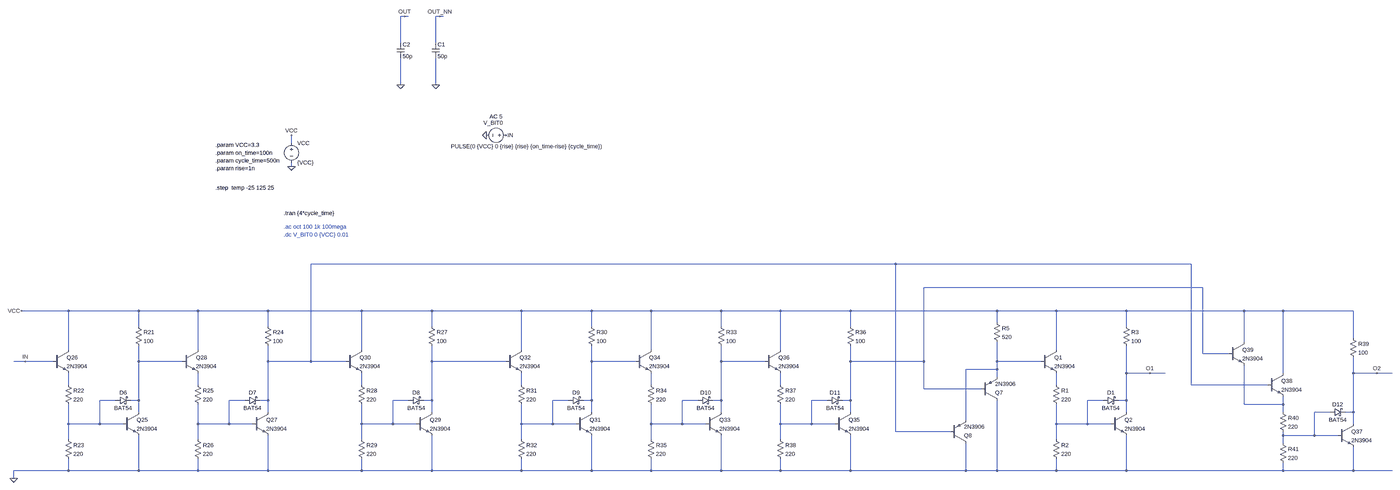
[diagram p0: schematic delay_line.asc, whole sheet]
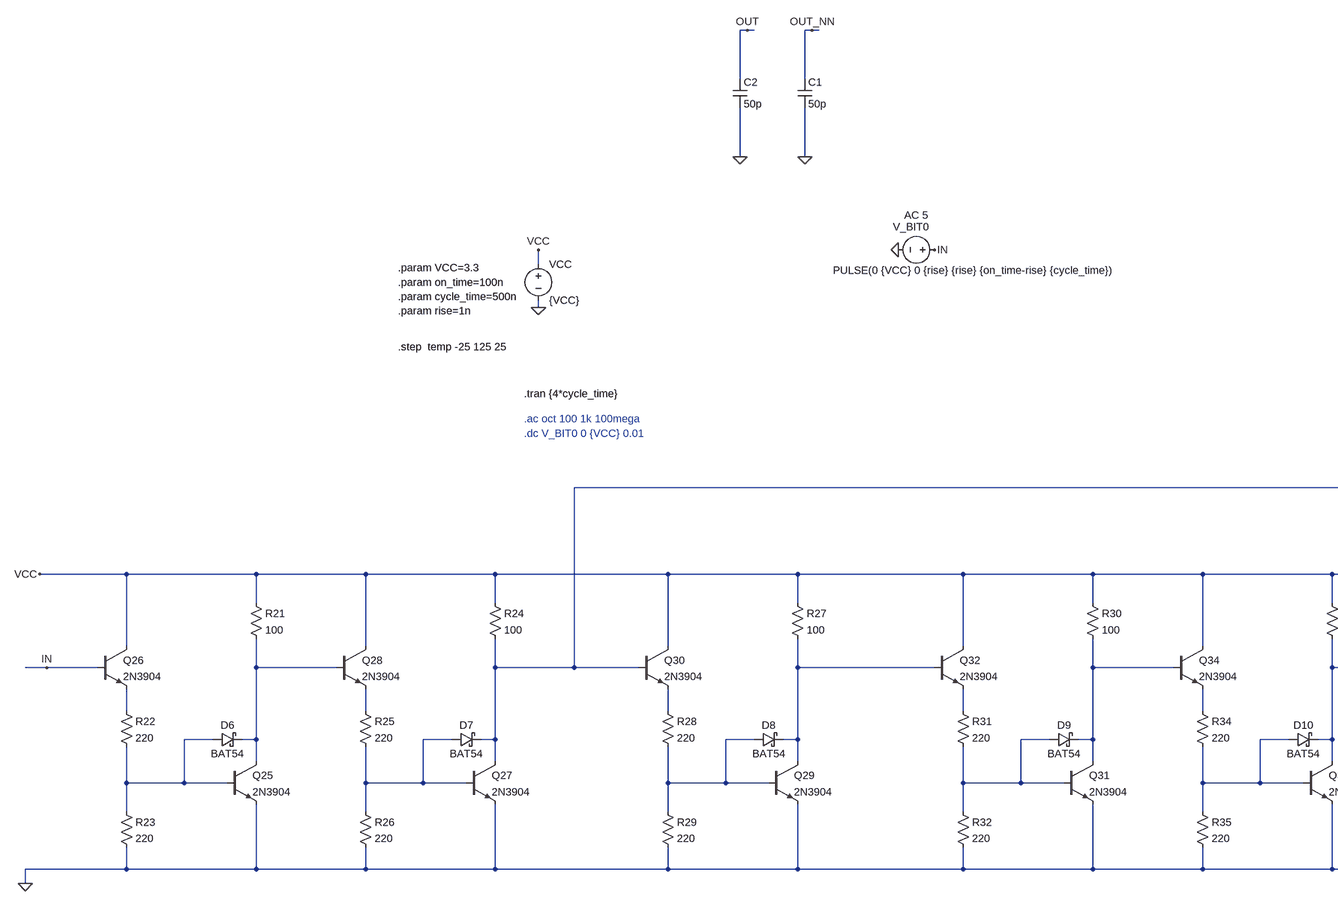
[diagram p1: schematic delay_line.asc, part, row 1 of 1, column 1 of 2]
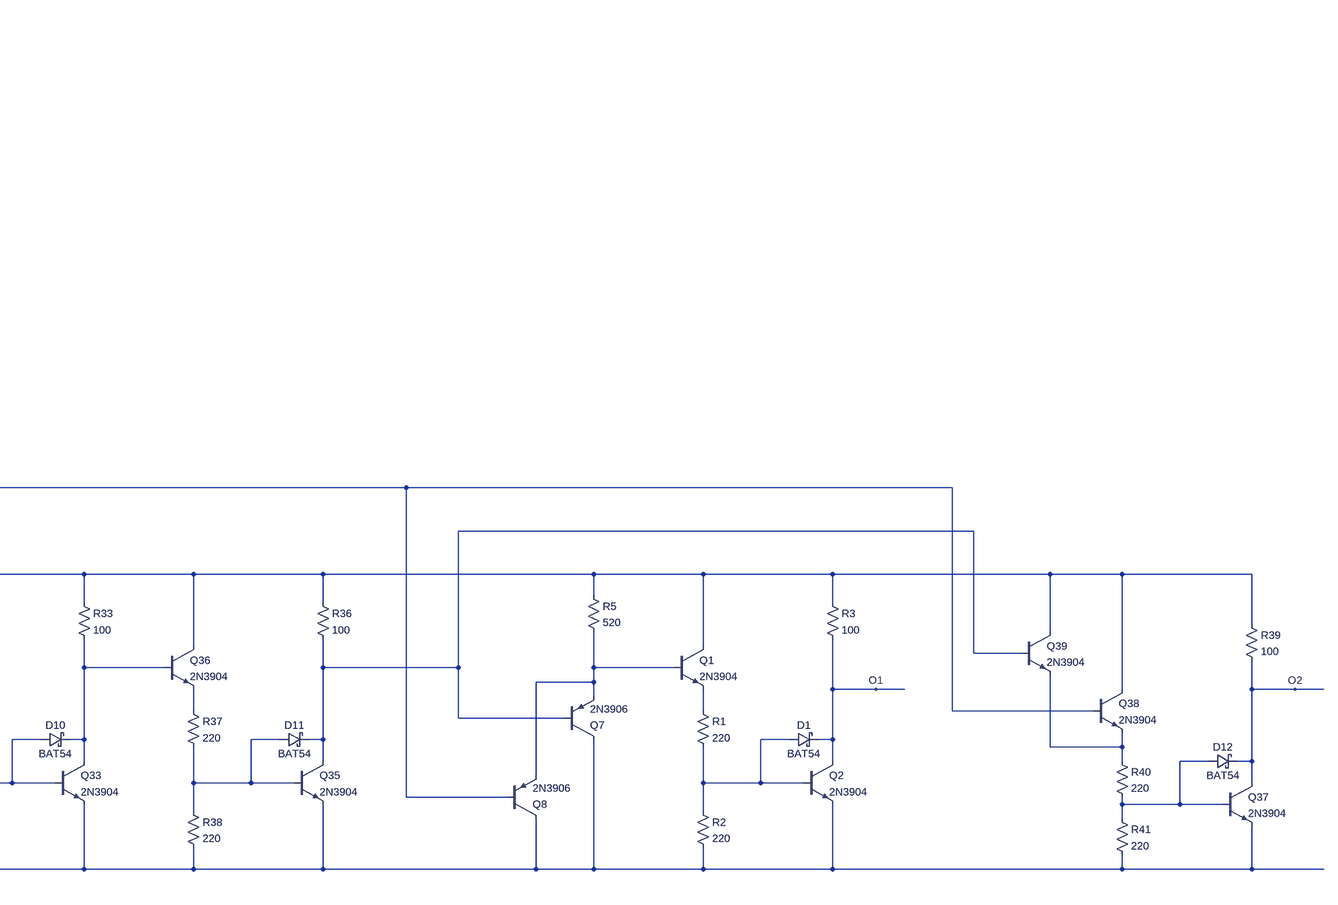
[diagram p2: schematic delay_line.asc, part, row 1 of 1, column 2 of 2]
delay_line.asc, the LTspice schematic file:
Version 4
SHEET 1 14868 10612
WIRE -288 80 -304 80
WIRE -272 80 -288 80
WIRE -144 80 -160 80
WIRE -128 80 -144 80
WIRE -304 208 -304 80
WIRE -160 208 -160 80
WIRE -304 480 -304 272
WIRE -160 480 -160 272
WIRE -752 912 -752 880
WIRE -752 1008 -752 992
WIRE 2048 2736 -672 2736
WIRE 3904 2736 2048 2736
WIRE 3952 2832 2272 2832
WIRE -1792 2928 -2032 2928
WIRE -1504 2928 -1792 2928
WIRE -1136 2928 -1504 2928
WIRE -848 2928 -1136 2928
WIRE -464 2928 -848 2928
WIRE -176 2928 -464 2928
WIRE 192 2928 -176 2928
WIRE 480 2928 192 2928
WIRE 864 2928 480 2928
WIRE 1152 2928 864 2928
WIRE 1520 2928 1152 2928
WIRE 1808 2928 1520 2928
WIRE 2576 2928 1808 2928
WIRE 3024 2928 2576 2928
WIRE 3312 2928 3024 2928
WIRE 4192 2928 3312 2928
WIRE 4352 2928 4192 2928
WIRE 4640 2928 4352 2928
WIRE 2576 2976 2576 2928
WIRE -1504 2992 -1504 2928
WIRE -848 2992 -848 2928
WIRE -176 2992 -176 2928
WIRE 480 2992 480 2928
WIRE 1152 2992 1152 2928
WIRE 1808 2992 1808 2928
WIRE 3312 2992 3312 2928
WIRE 4640 3040 4640 2928
WIRE 4192 3056 4192 2928
WIRE -1792 3088 -1792 2928
WIRE -1136 3088 -1136 2928
WIRE -464 3088 -464 2928
WIRE 192 3088 192 2928
WIRE 864 3088 864 2928
WIRE 1520 3088 1520 2928
WIRE 3024 3088 3024 2928
WIRE 3952 3104 3952 2832
WIRE 4128 3104 3952 3104
WIRE -2016 3136 -2064 3136
WIRE -1856 3136 -2016 3136
WIRE -1504 3136 -1504 3072
WIRE -1200 3136 -1504 3136
WIRE -848 3136 -848 3072
WIRE -672 3136 -672 2736
WIRE -672 3136 -848 3136
WIRE -528 3136 -672 3136
WIRE -176 3136 -176 3072
WIRE 128 3136 -176 3136
WIRE 480 3136 480 3072
WIRE 800 3136 480 3136
WIRE 1152 3136 1152 3072
WIRE 1456 3136 1152 3136
WIRE 1808 3136 1808 3072
WIRE 2272 3136 2272 2832
WIRE 2272 3136 1808 3136
WIRE 2576 3136 2576 3056
WIRE 2960 3136 2576 3136
WIRE 2576 3168 2576 3136
WIRE 2576 3168 2448 3168
WIRE 3312 3184 3312 3072
WIRE 3408 3184 3312 3184
WIRE 3472 3184 3408 3184
WIRE 4352 3184 4352 2928
WIRE 4640 3184 4640 3120
WIRE 4736 3184 4640 3184
WIRE 4800 3184 4736 3184
WIRE 2576 3200 2576 3168
WIRE -1792 3232 -1792 3184
WIRE -1136 3232 -1136 3184
WIRE -464 3232 -464 3184
WIRE 192 3232 192 3184
WIRE 864 3232 864 3184
WIRE 1520 3232 1520 3184
WIRE 3024 3232 3024 3184
WIRE 3904 3232 3904 2736
WIRE 4288 3232 3904 3232
WIRE 2272 3248 2272 3136
WIRE 2512 3248 2272 3248
WIRE -1600 3296 -1664 3296
WIRE -1504 3296 -1504 3136
WIRE -1504 3296 -1536 3296
WIRE -944 3296 -1008 3296
WIRE -848 3296 -848 3136
WIRE -848 3296 -880 3296
WIRE -272 3296 -336 3296
WIRE -176 3296 -176 3136
WIRE -176 3296 -208 3296
WIRE 384 3296 320 3296
WIRE 480 3296 480 3136
WIRE 480 3296 448 3296
WIRE 1056 3296 992 3296
WIRE 1152 3296 1152 3136
WIRE 1152 3296 1120 3296
WIRE 1712 3296 1648 3296
WIRE 1808 3296 1808 3136
WIRE 1808 3296 1776 3296
WIRE 3216 3296 3152 3296
WIRE 3312 3296 3312 3184
WIRE 3312 3296 3280 3296
WIRE 4192 3312 4192 3152
WIRE 4352 3312 4352 3280
WIRE 4352 3312 4192 3312
WIRE -1504 3344 -1504 3296
WIRE -848 3344 -848 3296
WIRE -176 3344 -176 3296
WIRE 480 3344 480 3296
WIRE 1152 3344 1152 3296
WIRE 1808 3344 1808 3296
WIRE 3312 3344 3312 3296
WIRE 4352 3344 4352 3312
WIRE 4544 3344 4480 3344
WIRE 4640 3344 4640 3184
WIRE 4640 3344 4608 3344
WIRE 2448 3376 2448 3168
WIRE -1792 3392 -1792 3312
WIRE -1664 3392 -1664 3296
WIRE -1664 3392 -1792 3392
WIRE -1568 3392 -1664 3392
WIRE -1136 3392 -1136 3312
WIRE -1008 3392 -1008 3296
WIRE -1008 3392 -1136 3392
WIRE -912 3392 -1008 3392
WIRE -464 3392 -464 3312
WIRE -336 3392 -336 3296
WIRE -336 3392 -464 3392
WIRE -240 3392 -336 3392
WIRE 192 3392 192 3312
WIRE 320 3392 320 3296
WIRE 320 3392 192 3392
WIRE 416 3392 320 3392
WIRE 864 3392 864 3312
WIRE 992 3392 992 3296
WIRE 992 3392 864 3392
WIRE 1088 3392 992 3392
WIRE 1520 3392 1520 3312
WIRE 1648 3392 1648 3296
WIRE 1648 3392 1520 3392
WIRE 1744 3392 1648 3392
WIRE 3024 3392 3024 3312
WIRE 3152 3392 3152 3296
WIRE 3152 3392 3024 3392
WIRE 3248 3392 3152 3392
WIRE 4640 3392 4640 3344
WIRE 2048 3424 2048 2736
WIRE 2384 3424 2048 3424
WIRE 4352 3440 4352 3424
WIRE 4480 3440 4480 3344
WIRE 4480 3440 4352 3440
WIRE 4576 3440 4480 3440
WIRE -1792 3456 -1792 3392
WIRE -1136 3456 -1136 3392
WIRE -464 3456 -464 3392
WIRE 192 3456 192 3392
WIRE 864 3456 864 3392
WIRE 1520 3456 1520 3392
WIRE 3024 3456 3024 3392
WIRE 4352 3472 4352 3440
WIRE -1792 3584 -1792 3536
WIRE -1792 3584 -2064 3584
WIRE -1504 3584 -1504 3440
WIRE -1504 3584 -1792 3584
WIRE -1136 3584 -1136 3536
WIRE -1136 3584 -1504 3584
WIRE -848 3584 -848 3440
WIRE -848 3584 -1136 3584
WIRE -464 3584 -464 3536
WIRE -464 3584 -848 3584
WIRE -176 3584 -176 3440
WIRE -176 3584 -464 3584
WIRE 192 3584 192 3536
WIRE 192 3584 -176 3584
WIRE 480 3584 480 3440
WIRE 480 3584 192 3584
WIRE 864 3584 864 3536
WIRE 864 3584 480 3584
WIRE 1152 3584 1152 3440
WIRE 1152 3584 864 3584
WIRE 1520 3584 1520 3536
WIRE 1520 3584 1152 3584
WIRE 1808 3584 1808 3440
WIRE 1808 3584 1520 3584
WIRE 2448 3584 2448 3472
WIRE 2448 3584 1808 3584
WIRE 2576 3584 2576 3296
WIRE 2576 3584 2448 3584
WIRE 3024 3584 3024 3536
WIRE 3024 3584 2576 3584
WIRE 3312 3584 3312 3440
WIRE 3312 3584 3024 3584
WIRE 4352 3584 4352 3552
WIRE 4352 3584 3312 3584
WIRE 4640 3584 4640 3488
WIRE 4640 3584 4352 3584
WIRE 4800 3584 4640 3584
WIRE -2064 3616 -2064 3584
FLAG -752 1008 0
FLAG 128 880 IN
FLAG -752 880 VCC
FLAG 48 880 0
FLAG 3408 3184 O1
FLAG -288 80 OUT
FLAG -304 480 0
FLAG -144 80 OUT_NN
FLAG -160 480 0
FLAG -2032 2928 VCC
FLAG -2016 3136 IN
FLAG -2064 3616 0
FLAG 4736 3184 O2
SYMBOL voltage -752 896 R0
WINDOW 123 0 0 Left 0
WINDOW 39 0 0 Left 0
SYMATTR InstName VCC
SYMATTR Value {VCC}
SYMBOL voltage 144 880 R90
WINDOW 123 -77 30 VRight 2
WINDOW 39 0 0 Left 0
WINDOW 0 -51 28 VRight 2
WINDOW 3 46 -379 VRight 2
SYMATTR Value2 AC 5
SYMATTR InstName V_BIT0
SYMATTR Value PULSE(0 {VCC} 0 {rise} {rise} {on_time-rise} {cycle_time})
SYMBOL npn 3248 3344 R0
SYMATTR InstName Q2
SYMATTR Value 2N3904
SYMBOL schottky 3216 3312 R270
WINDOW 0 32 32 VTop 2
WINDOW 3 0 32 VBottom 2
SYMATTR InstName D1
SYMATTR Value BAT54
SYMATTR Description Diode
SYMATTR Type diode
SYMBOL npn 2960 3088 R0
SYMATTR InstName Q1
SYMATTR Value 2N3904
SYMBOL res 3296 2976 R0
SYMATTR InstName R3
SYMATTR Value 100
SYMBOL res 3008 3216 R0
SYMATTR InstName R1
SYMATTR Value 220
SYMBOL res 3008 3440 R0
SYMATTR InstName R2
SYMATTR Value 220
SYMBOL cap -320 208 R0
SYMATTR InstName C2
SYMATTR Value 50p
SYMBOL pnp 2512 3296 M180
SYMATTR InstName Q7
SYMATTR Value 2N3906
SYMBOL pnp 2384 3472 M180
SYMATTR InstName Q8
SYMATTR Value 2N3906
SYMBOL res 2560 2960 R0
SYMATTR InstName R5
SYMATTR Value 520
SYMBOL cap -176 208 R0
SYMATTR InstName C1
SYMATTR Value 50p
SYMBOL npn -1568 3344 R0
SYMATTR InstName Q25
SYMATTR Value 2N3904
SYMBOL schottky -1600 3312 R270
WINDOW 0 32 32 VTop 2
WINDOW 3 0 32 VBottom 2
SYMATTR InstName D6
SYMATTR Value BAT54
SYMATTR Description Diode
SYMATTR Type diode
SYMBOL npn -1856 3088 R0
SYMATTR InstName Q26
SYMATTR Value 2N3904
SYMBOL res -1520 2976 R0
SYMATTR InstName R21
SYMATTR Value 100
SYMBOL res -1808 3216 R0
SYMATTR InstName R22
SYMATTR Value 220
SYMBOL res -1808 3440 R0
SYMATTR InstName R23
SYMATTR Value 220
SYMBOL npn -912 3344 R0
SYMATTR InstName Q27
SYMATTR Value 2N3904
SYMBOL schottky -944 3312 R270
WINDOW 0 32 32 VTop 2
WINDOW 3 0 32 VBottom 2
SYMATTR InstName D7
SYMATTR Value BAT54
SYMATTR Description Diode
SYMATTR Type diode
SYMBOL npn -1200 3088 R0
SYMATTR InstName Q28
SYMATTR Value 2N3904
SYMBOL res -864 2976 R0
SYMATTR InstName R24
SYMATTR Value 100
SYMBOL res -1152 3216 R0
SYMATTR InstName R25
SYMATTR Value 220
SYMBOL res -1152 3440 R0
SYMATTR InstName R26
SYMATTR Value 220
SYMBOL npn -240 3344 R0
SYMATTR InstName Q29
SYMATTR Value 2N3904
SYMBOL schottky -272 3312 R270
WINDOW 0 32 32 VTop 2
WINDOW 3 0 32 VBottom 2
SYMATTR InstName D8
SYMATTR Value BAT54
SYMATTR Description Diode
SYMATTR Type diode
SYMBOL npn -528 3088 R0
SYMATTR InstName Q30
SYMATTR Value 2N3904
SYMBOL res -192 2976 R0
SYMATTR InstName R27
SYMATTR Value 100
SYMBOL res -480 3216 R0
SYMATTR InstName R28
SYMATTR Value 220
SYMBOL res -480 3440 R0
SYMATTR InstName R29
SYMATTR Value 220
SYMBOL npn 416 3344 R0
SYMATTR InstName Q31
SYMATTR Value 2N3904
SYMBOL schottky 384 3312 R270
WINDOW 0 32 32 VTop 2
WINDOW 3 0 32 VBottom 2
SYMATTR InstName D9
SYMATTR Value BAT54
SYMATTR Description Diode
SYMATTR Type diode
SYMBOL npn 128 3088 R0
SYMATTR InstName Q32
SYMATTR Value 2N3904
SYMBOL res 464 2976 R0
SYMATTR InstName R30
SYMATTR Value 100
SYMBOL res 176 3216 R0
SYMATTR InstName R31
SYMATTR Value 220
SYMBOL res 176 3440 R0
SYMATTR InstName R32
SYMATTR Value 220
SYMBOL npn 1088 3344 R0
SYMATTR InstName Q33
SYMATTR Value 2N3904
SYMBOL schottky 1056 3312 R270
WINDOW 0 32 32 VTop 2
WINDOW 3 0 32 VBottom 2
SYMATTR InstName D10
SYMATTR Value BAT54
SYMATTR Description Diode
SYMATTR Type diode
SYMBOL npn 800 3088 R0
SYMATTR InstName Q34
SYMATTR Value 2N3904
SYMBOL res 1136 2976 R0
SYMATTR InstName R33
SYMATTR Value 100
SYMBOL res 848 3216 R0
SYMATTR InstName R34
SYMATTR Value 220
SYMBOL res 848 3440 R0
SYMATTR InstName R35
SYMATTR Value 220
SYMBOL npn 1744 3344 R0
SYMATTR InstName Q35
SYMATTR Value 2N3904
SYMBOL schottky 1712 3312 R270
WINDOW 0 32 32 VTop 2
WINDOW 3 0 32 VBottom 2
SYMATTR InstName D11
SYMATTR Value BAT54
SYMATTR Description Diode
SYMATTR Type diode
SYMBOL npn 1456 3088 R0
SYMATTR InstName Q36
SYMATTR Value 2N3904
SYMBOL res 1792 2976 R0
SYMATTR InstName R36
SYMATTR Value 100
SYMBOL res 1504 3216 R0
SYMATTR InstName R37
SYMATTR Value 220
SYMBOL res 1504 3440 R0
SYMATTR InstName R38
SYMATTR Value 220
SYMBOL npn 4576 3392 R0
SYMATTR InstName Q37
SYMATTR Value 2N3904
SYMBOL schottky 4544 3360 R270
WINDOW 0 32 32 VTop 2
WINDOW 3 0 32 VBottom 2
SYMATTR InstName D12
SYMATTR Value BAT54
SYMATTR Description Diode
SYMATTR Type diode
SYMBOL npn 4288 3184 R0
SYMATTR InstName Q38
SYMATTR Value 2N3904
SYMBOL res 4624 3024 R0
SYMATTR InstName R39
SYMATTR Value 100
SYMBOL res 4336 3328 R0
SYMATTR InstName R40
SYMATTR Value 220
SYMBOL res 4336 3456 R0
SYMATTR InstName R41
SYMATTR Value 220
SYMBOL npn 4128 3056 R0
SYMATTR InstName Q39
SYMATTR Value 2N3904
TEXT -784 1200 Left 2 !.tran {4*cycle_time}
TEXT -784 1256 Left 2 ;.ac oct 100 1k 100mega
TEXT -784 1288 Left 2 ;.dc V_BIT0 0 {VCC} 0.01
TEXT -1064 920 Left 2 !.param VCC=3.3
TEXT -1064 952 Left 2 !.param on_time=100n
TEXT -1064 1016 Left 2 !.param rise=1n
TEXT -1064 1096 Left 2 !.step  temp -25 125 25
TEXT -1064 984 Left 2 !.param cycle_time=500n

The netlist it stands for:
* delay_line.asc
VCC VCC 0 {VCC}
V_BIT0 IN 0 PULSE(0 {VCC} 0 {rise} {rise} {on_time-rise} {cycle_time}) AC 5
Q2 O1 N021 0 0 2N3904
D1 N021 O1 BAT54
Q1 VCC N007 N014 0 2N3904
R3 VCC O1 100
R1 N014 N021 220
R2 N021 0 220
C2 OUT 0 50p
Q7 0 N002 N007 0 2N3906
Q8 0 N001 N007 0 2N3906
R5 VCC N007 520
C1 OUT_NN 0 50p
Q25 N003 N015 0 0 2N3904
D6 N015 N003 BAT54
Q26 VCC IN N008 0 2N3904
R21 VCC N003 100
R22 N008 N015 220
R23 N015 0 220
Q27 N001 N016 0 0 2N3904
D7 N016 N001 BAT54
Q28 VCC N003 N009 0 2N3904
R24 VCC N001 100
R25 N009 N016 220
R26 N016 0 220
Q29 N004 N017 0 0 2N3904
D8 N017 N004 BAT54
Q30 VCC N001 N010 0 2N3904
R27 VCC N004 100
R28 N010 N017 220
R29 N017 0 220
Q31 N005 N018 0 0 2N3904
D9 N018 N005 BAT54
Q32 VCC N004 N011 0 2N3904
R30 VCC N005 100
R31 N011 N018 220
R32 N018 0 220
Q33 N006 N019 0 0 2N3904
D10 N019 N006 BAT54
Q34 VCC N005 N012 0 2N3904
R33 VCC N006 100
R34 N012 N019 220
R35 N019 0 220
Q35 N002 N020 0 0 2N3904
D11 N020 N002 BAT54
Q36 VCC N006 N013 0 2N3904
R36 VCC N002 100
R37 N013 N020 220
R38 N020 0 220
Q37 O2 N023 0 0 2N3904
D12 N023 O2 BAT54
Q38 VCC N001 N022 0 2N3904
R39 VCC O2 100
R40 N022 N023 220
R41 N023 0 220
Q39 VCC N002 N022 0 2N3904
.model D D
.lib standard.dio
.model NPN NPN
.model PNP PNP
.lib standard.bjt
.tran {4*cycle_time}
* .ac oct 100 1k 100mega
* .dc V_BIT0 0 {VCC} 0.01
.param VCC=3.3
.param on_time=100n
.param rise=1n
.step  temp -25 125 25
.param cycle_time=500n
.backanno
.end